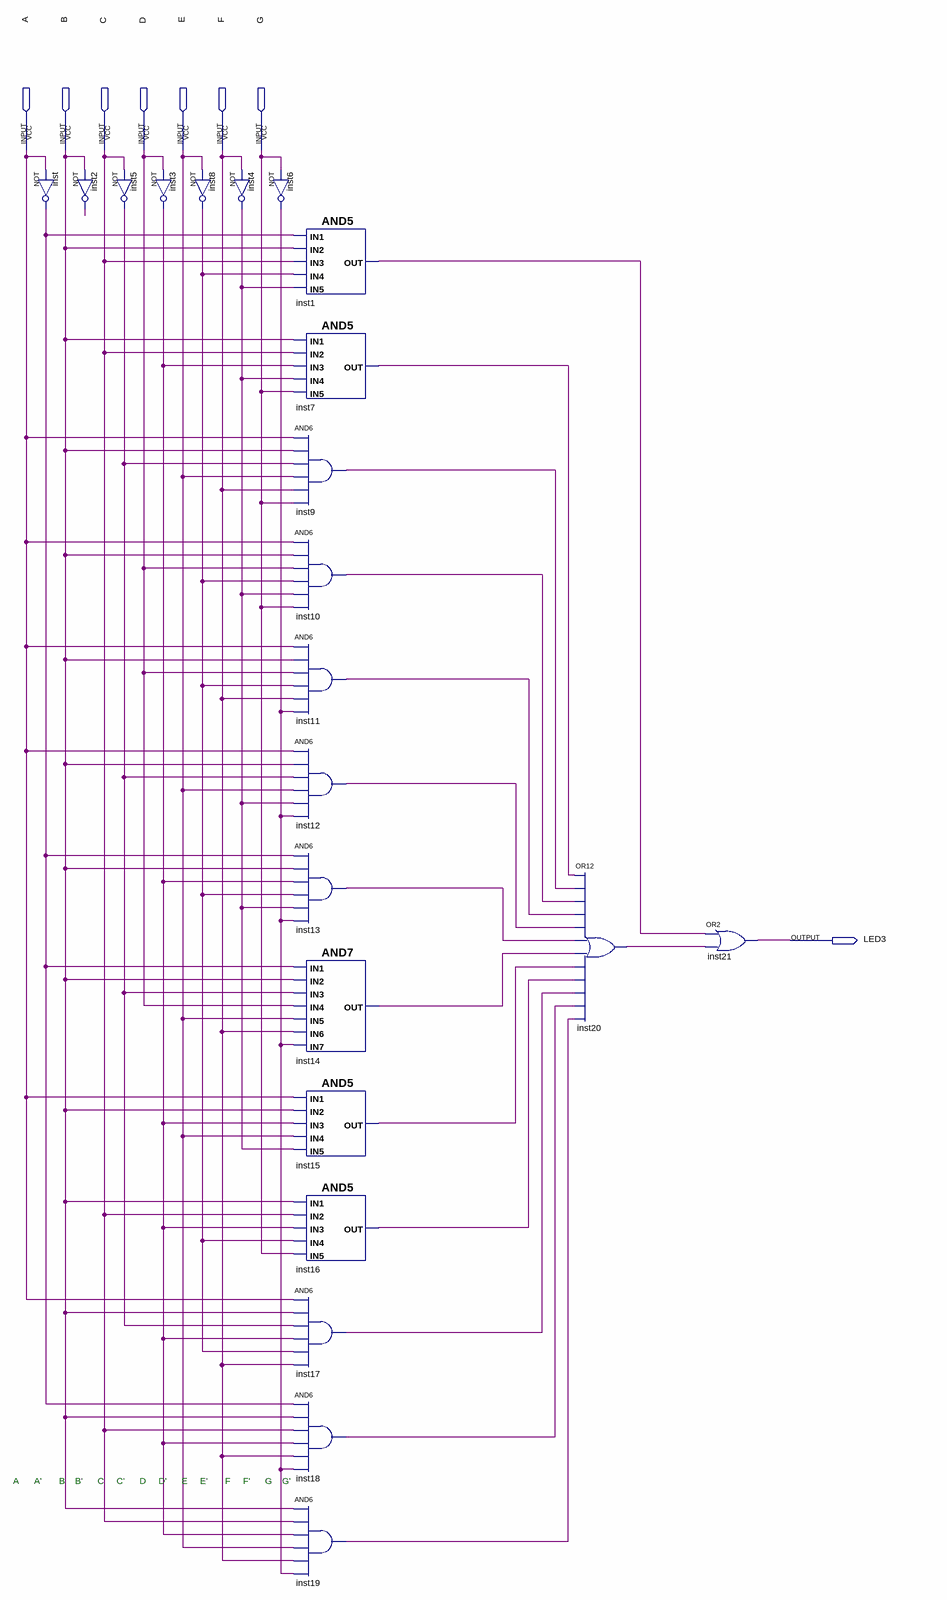
[diagram p0: schematic sheet]
// Quartus schematic LED3LINHA7MATRIZ.bdf as structural Verilog: 22 symbols, 8 pins
module LED3LINHA7MATRIZ (
  input  A,
  input  B,
  input  C,
  input  D,
  input  E,
  input  F,
  input  G,
  output LED3
);

  wire inst1_out, inst2_out, inst3_out, inst4_out, inst5_out, inst6_out, inst7_out, inst8_out, inst9_out,
       inst10_out, inst11_out, inst12_out, inst13_out, inst14_out, inst15_out, inst16_out, inst17_out,
       inst18_out, inst19_out, inst20_out, inst_out;

  not inst (inst_out, A);
  not inst2 (inst2_out, B);
  not inst5 (inst5_out, C);
  not inst3 (inst3_out, D);
  not inst8 (inst8_out, E);
  not inst4 (inst4_out, F);
  not inst6 (inst6_out, G);
  and inst1 (inst1_out, inst_out, B, C, inst8_out, inst4_out);
  and inst7 (inst7_out, B, C, inst3_out, inst4_out, G);
  and inst9 (inst9_out, A, B, inst5_out, E, F, G);
  and inst10 (inst10_out, A, B, D, inst8_out, inst4_out, G);
  and inst11 (inst11_out, A, B, D, inst8_out, F, inst6_out);
  and inst12 (inst12_out, A, B, inst5_out, E, inst4_out, inst6_out);
  and inst13 (inst13_out, inst_out, B, inst3_out, inst8_out, inst4_out, inst6_out);
  and inst14 (inst14_out, inst_out, B, inst5_out, D, E, F, inst6_out);
  and inst15 (inst15_out, A, B, inst3_out, E, inst4_out);
  and inst16 (inst16_out, B, C, inst3_out, inst8_out, G);
  and inst17 (inst17_out, A, B, inst5_out, inst3_out, inst8_out, F);
  and inst18 (inst18_out, inst_out, B, C, inst3_out, F, inst6_out);
  and inst19 (inst19_out, B, C, inst3_out, E, F, inst6_out);
  or inst20 (inst20_out, inst7_out, inst9_out, inst10_out, inst11_out, inst12_out, inst13_out, inst14_out, inst15_out, inst16_out, inst17_out, inst18_out, inst19_out);
  or inst21 (LED3, inst1_out, inst20_out);

  // Notes on the sheet:
  //   A      A'       B    B'      C     C'      D     D'      E     E'       F     F'      G    G'
endmodule
